# Altium schematic sheet DiagLEDs.SchDoc
size A4; CompanyName: Technische Hochschule Nürnberg Georg Simon Ohm; Organization: UltraZohm; Address1: Kesslerplatz 12; Address2: 90489 Nürnberg; Address3: GERMANY; SheetNumber: 22; SheetTotal: 36; Website: www.ultrazohm.com
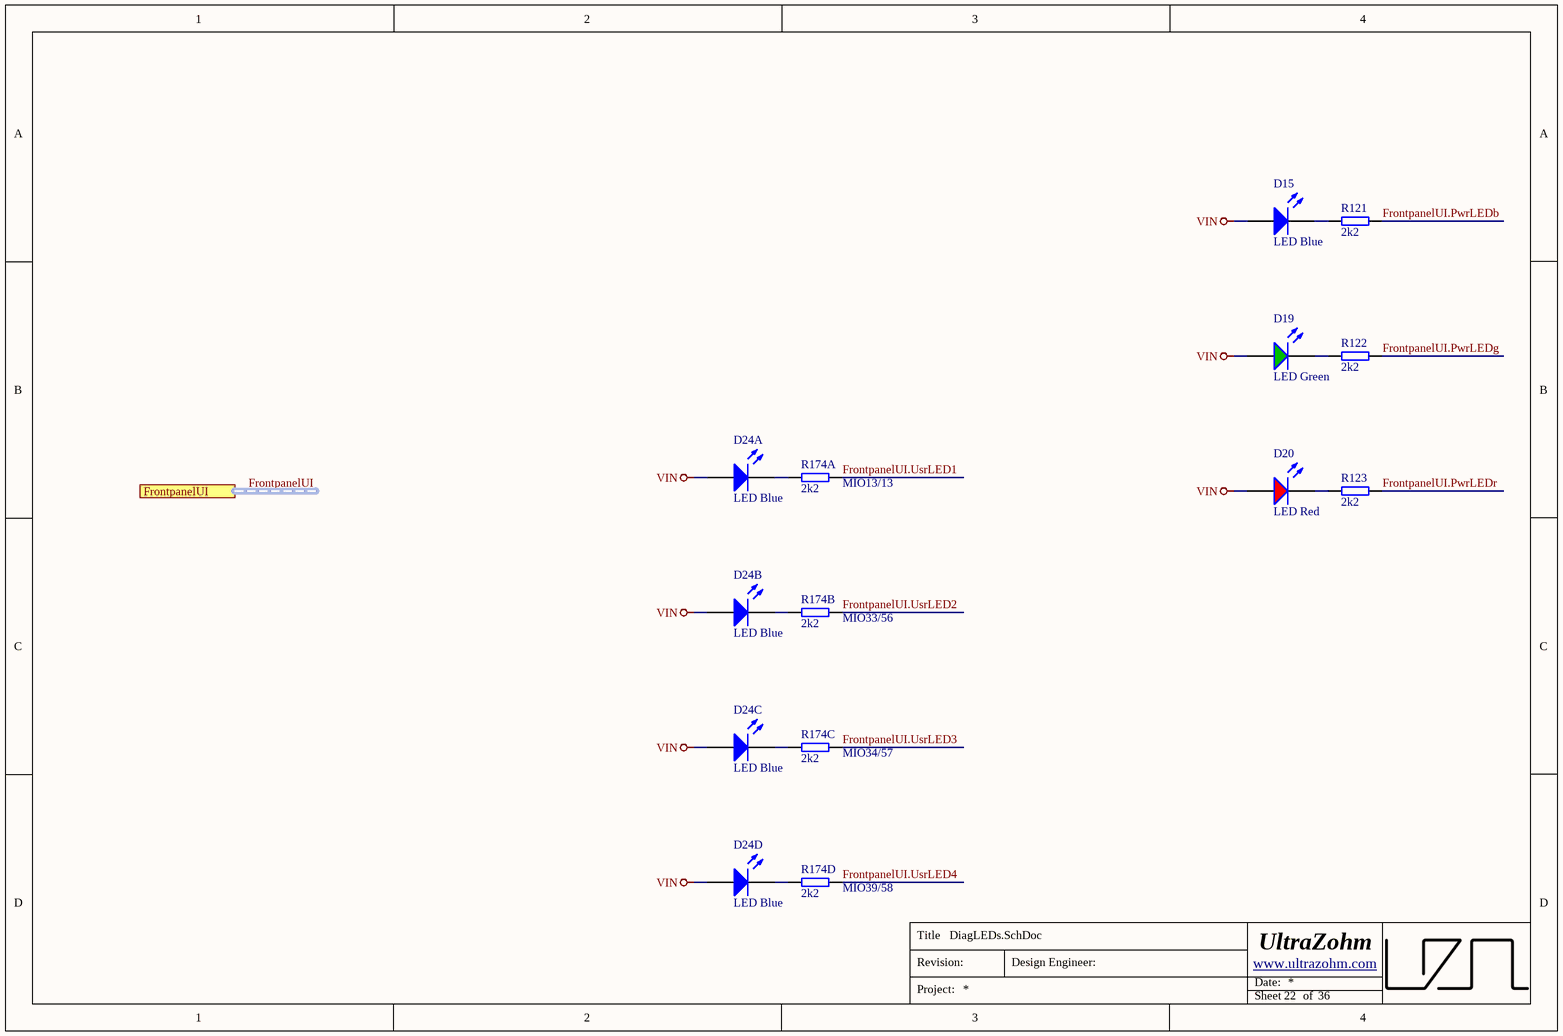
[diagram p0: DiagLEDs.SchDoc]

## Parts
D15  LED Blue  [WL-SMCW_0603]
D19  LED Green  [WL-SMCW_0603]
D20  LED Red  [WL-SMCW_0603]
D24A  LED Blue  [WL-SMCW_0603]
D24B  LED Blue  [WL-SMCW_0603]
D24C  LED Blue  [WL-SMCW_0603]
D24D  LED Blue  [WL-SMCW_0603]
R121  2k2  [R_1206_TE]
R122  2k2  [R_1206_TE]
R123  2k2  [R_1206_TE]
R174A  2k2  [R_1206_TE]
R174B  2k2  [R_1206_TE]
R174C  2k2  [R_1206_TE]
R174D  2k2  [R_1206_TE]

## Ports
FrontpanelUI (harness FrontpanelUI)

## Nets
VIN: D15.2(A) D19.2(A) D20.2(A) D24A.2(A) D24B.2(A) D24C.2(A) D24D.2(A)
FrontpanelUI.PwrLEDb: R121.2
FrontpanelUI.PwrLEDg: R122.2
FrontpanelUI.PwrLEDr: R123.2
FrontpanelUI.UsrLED1: R174A.2
FrontpanelUI.UsrLED2: R174B.2
FrontpanelUI.UsrLED3: R174C.2
FrontpanelUI.UsrLED4: R174D.2
NetD15_1: D15.1(K) R121.1
NetD19_1: D19.1(K) R122.1
NetD20_1: D20.1(K) R123.1
NetD24A_1: D24A.1(K) R174A.1
NetD24B_1: D24B.1(K) R174B.1
NetD24C_1: D24C.1(K) R174C.1
NetD24D_1: D24D.1(K) R174D.1

## Buses and harness runs
harness FrontpanelUI = port FrontpanelUI

## Notes on the sheet
- (near R174A) MIO13/13
- (near R174B) MIO33/56
- (near R174C) MIO34/57
- (near R174D) MIO39/58
- Title
- Revision:
- Design Engineer:
- Date:
- Project:
- Sheet
- of

## Library data of the parts
D15 D24A D24B D24C D24D = UZgen_LED_0603_Blue: Standard LEDs - SMD 0603 blue; Manufacturer: UZgen; Created from: UZgenTool; Manufacturer Part Number: UZgen_LED_0603_Blue; PartID: 20; Created On: 09/09/2024 10:45:01; ComponentLink1Description: N/A; ComponentLink1URL: N/A; Component Type: LED Diode; Device Package: 0603; Last Updated: 09/09/2024 10:45:01; Mounting Type: SMD; Supplier 1: LCSC; Supplier Part Number 1: =LCSC Part Number; Type: Standard; Value: LED Blue; Live Cycle Status: 1; Stock number: not stored; Color: blue
D19 = UZgen_LED_0603_Green: Standard LEDs - SMD 0603 green; Manufacturer: UZgen; Created from: UZgenTool; Manufacturer Part Number: UZgen_LED_0603_Green; PartID: 21; Created On: 09/09/2024 10:45:01; ComponentLink1Description: N/A; ComponentLink1URL: N/A; Component Type: LED Diode; Device Package: 0603; Last Updated: 09/09/2024 10:45:01; Mounting Type: SMD; Supplier 1: LCSC; Supplier Part Number 1: =LCSC Part Number; Type: Standard; Value: LED Green; Live Cycle Status: 1; Stock number: not stored; Color: green
D20 = UZgen_LED_0603_Red: Standard LEDs - SMD 0603 red; Manufacturer: UZgen; Created from: UZgenTool; Manufacturer Part Number: UZgen_LED_0603_Red; PartID: 22; Created On: 09/09/2024 10:45:01; ComponentLink1Description: N/A; ComponentLink1URL: N/A; Component Type: LED Diode; Device Package: 0603; Last Updated: 09/09/2024 10:45:01; Mounting Type: SMD; Supplier 1: LCSC; Supplier Part Number 1: =LCSC Part Number; Type: Standard; Value: LED Red; Live Cycle Status: 1; Stock number: not stored; Color: red
R121-R123 R174A R174B R174C R174D = UZgen_R_1206_2k2: Generic resistor; Manufacturer: UZgen; Tolerance: 1 %; Created from: UZgenTool; Value: 2k2; Manufacturer Part Number: UZgen_R_1206_2k2; PartID: 516; Created On: 02/07/2024 17:29:56; Device Package: 1206; Mounting Type: SMD; Last Updated: 02/07/2024 17:29:56